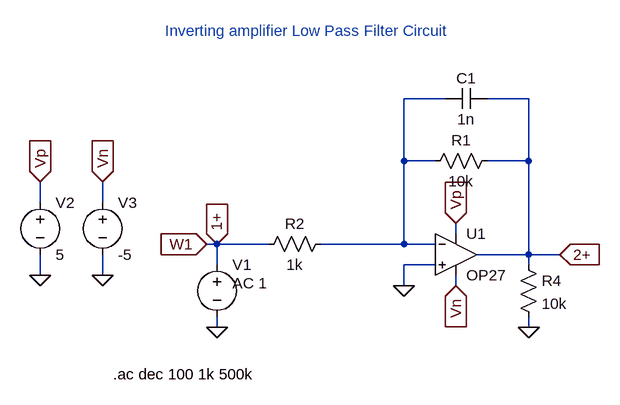
[diagram p0: schematic inv_alpf_gain.asc]
inv_alpf_gain.asc, the LTspice schematic file:
Version 4
SHEET 1 880 680
WIRE 480 -96 416 -96
WIRE 608 -96 544 -96
WIRE 416 0 416 -96
WIRE 464 0 416 0
WIRE 608 0 608 -96
WIRE 608 0 544 0
WIRE -144 64 -144 32
WIRE -48 64 -48 32
WIRE 496 112 496 96
WIRE 128 128 112 128
WIRE 208 128 128 128
WIRE 416 128 416 0
WIRE 416 128 288 128
WIRE 464 128 416 128
WIRE 608 144 608 0
WIRE 608 144 528 144
WIRE 656 144 608 144
WIRE 128 160 128 128
WIRE 464 160 416 160
WIRE 608 160 608 144
WIRE -144 176 -144 144
WIRE -48 176 -48 144
WIRE 416 192 416 160
WIRE 496 192 496 176
WIRE 128 256 128 240
WIRE 608 256 608 240
FLAG 128 256 0
FLAG -144 176 0
FLAG -48 176 0
FLAG -144 32 Vp
IOPIN -144 32 In
FLAG -48 32 Vn
IOPIN -48 32 In
FLAG 496 96 Vp
IOPIN 496 96 In
FLAG 496 192 Vn
IOPIN 496 192 In
FLAG 608 256 0
FLAG 656 144 2+
IOPIN 656 144 In
FLAG 112 128 W1
IOPIN 112 128 In
FLAG 128 128 1+
IOPIN 128 128 In
FLAG 416 192 0
SYMBOL Opamps\\OP27 496 80 R0
SYMATTR InstName U1
SYMBOL cap 544 -112 R90
WINDOW 0 0 32 VBottom 2
WINDOW 3 32 32 VTop 2
SYMATTR InstName C1
SYMATTR Value 1n
SYMBOL voltage 128 144 R0
WINDOW 123 24 44 Left 2
WINDOW 39 0 0 Left 0
SYMATTR Value2 AC 1
SYMATTR InstName V1
SYMATTR Value ""
SYMBOL voltage -144 48 R0
WINDOW 123 0 0 Left 0
WINDOW 39 0 0 Left 0
SYMATTR InstName V2
SYMATTR Value 5
SYMBOL voltage -48 48 R0
WINDOW 123 0 0 Left 0
WINDOW 39 0 0 Left 0
SYMATTR InstName V3
SYMATTR Value -5
SYMBOL res 592 144 R0
SYMATTR InstName R4
SYMATTR Value 10k
SYMBOL res 560 -16 R90
WINDOW 0 0 56 VBottom 2
WINDOW 3 32 56 VTop 2
SYMATTR InstName R1
SYMATTR Value 10k
SYMBOL res 304 112 R90
WINDOW 0 0 56 VBottom 2
WINDOW 3 32 56 VTop 2
SYMATTR InstName R2
SYMATTR Value 1k
TEXT -32 328 Left 2 !.ac dec 100 1k 500k
TEXT 48 -200 Left 2 ;Inverting amplifier Low Pass Filter Circuit

The netlist it stands for:
* inv_alpf_gain.asc
XU1 0 N001 Vp Vn 2+ OP27  ; pins In+ In- V+ V- OUT
C1 2+ N001 1n
V1 1+ 0 AC 1
V2 Vp 0 5
V3 Vn 0 -5
R4 2+ 0 10k
R1 2+ N001 10k
R2 N001 1+ 1k
.ac dec 100 1k 500k
* Inverting amplifier Low Pass Filter Circuit
.lib ADI.lib
.backanno
.end